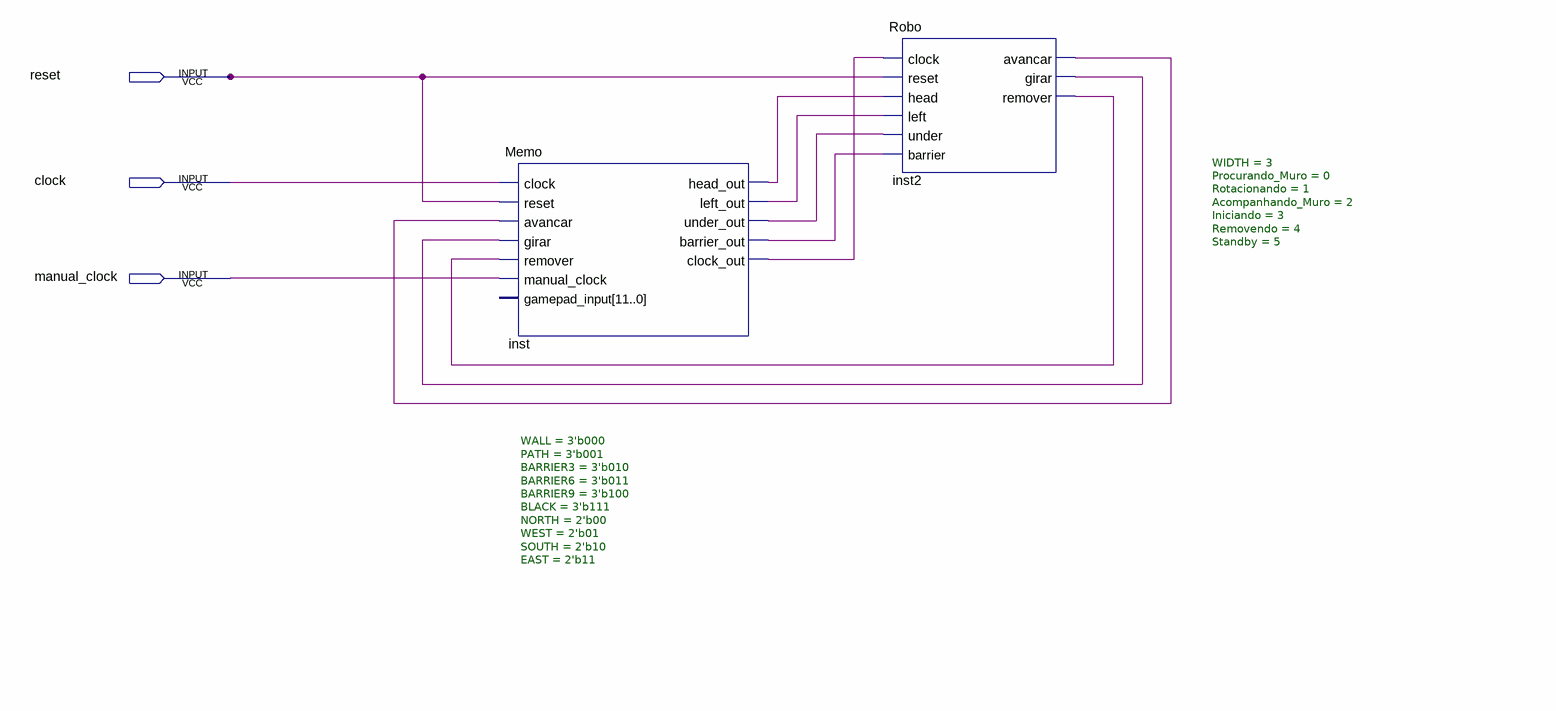
[diagram p0: schematic sheet]
// Quartus schematic new_top.bdf as structural Verilog: 2 symbols, 3 pins
module new_top (
  input  reset,
  input  clock,
  input  manual_clock
);

  wire inst2_avancar, inst2_girar, inst2_remover, inst_barrier_out, inst_clock_out, inst_head_out,
       inst_left_out, inst_under_out;

  Memo #(.WALL(3'b000), .PATH(3'b001), .BARRIER3(3'b010), .BARRIER6(3'b011), .BARRIER9(3'b100), .BLACK(3'b111), .NORTH(2'b00), .WEST(2'b01), .SOUTH(2'b10), .EAST(2'b11)) inst (
    .clock(clock), .reset(reset), .avancar(inst2_avancar), .girar(inst2_girar), .remover(inst2_remover),
    .manual_clock(manual_clock), .head_out(inst_head_out), .left_out(inst_left_out),
    .under_out(inst_under_out), .barrier_out(inst_barrier_out), .clock_out(inst_clock_out));  // open: gamepad_input
  Robo #(.WIDTH(3), .Procurando_Muro(0), .Rotacionando(1), .Acompanhando_Muro(2), .Iniciando(3), .Removendo(4), .Standby(5)) inst2 (
    .clock(inst_clock_out), .reset(reset), .head(inst_head_out), .left(inst_left_out),
    .under(inst_under_out), .barrier(inst_barrier_out), .avancar(inst2_avancar), .girar(inst2_girar),
    .remover(inst2_remover));
endmodule
